# EAGLE schematic fire_alarm (EAGLE 7.1.0)
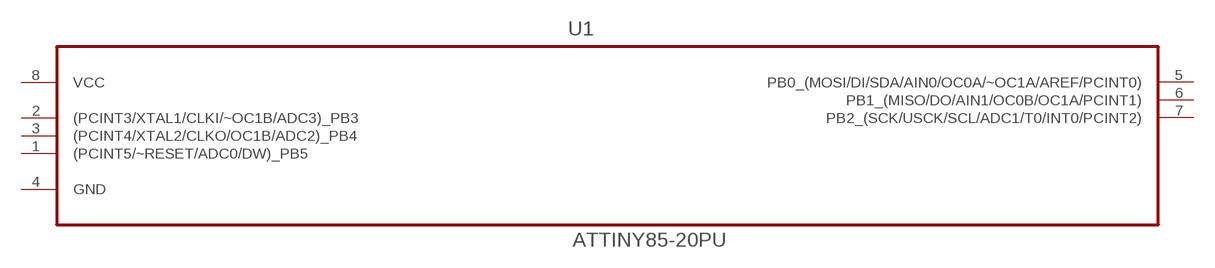
[diagram p0: schematic, sheet 1]

## Parts
U1  ATTINY85-20PU  [DIP254P762X533-8]
Unconnected: U1.1((PCINT5/~RESET/ADC0/DW)_PB5) U1.2((PCINT3/XTAL1/CLKI/~OC1B/ADC3)_PB3) U1.3((PCINT4/XTAL2/CLKO/OC1B/ADC2)_PB4) U1.4(GND) U1.5(PB0_(MOSI/DI/SDA/AIN0/OC0A/~OC1A/AREF/PCINT0)) U1.6(PB1_(MISO/DO/AIN1/OC0B/OC1A/PCINT1)) U1.7(PB2_(SCK/USCK/SCL/ADC1/T0/INT0/PCINT2))

## Power pins joined to a net without a drawn wire
VCC: U1.8(VCC)

## Library data of the parts
U1 = Atmel_By_element14_Batch_1-00:ATTINY85-20PU: 8-bit Microcontroller with In-System Programmable Flash; MPN: ATTINY85-20PU; OC_FARNELL: 1455162; OC_NEWARK: 58M3796; PACKAGE: PDIP-8; SUPPLIER: Atmel